# EAGLE design Charge_Controller (EAGLE 9.5.0)
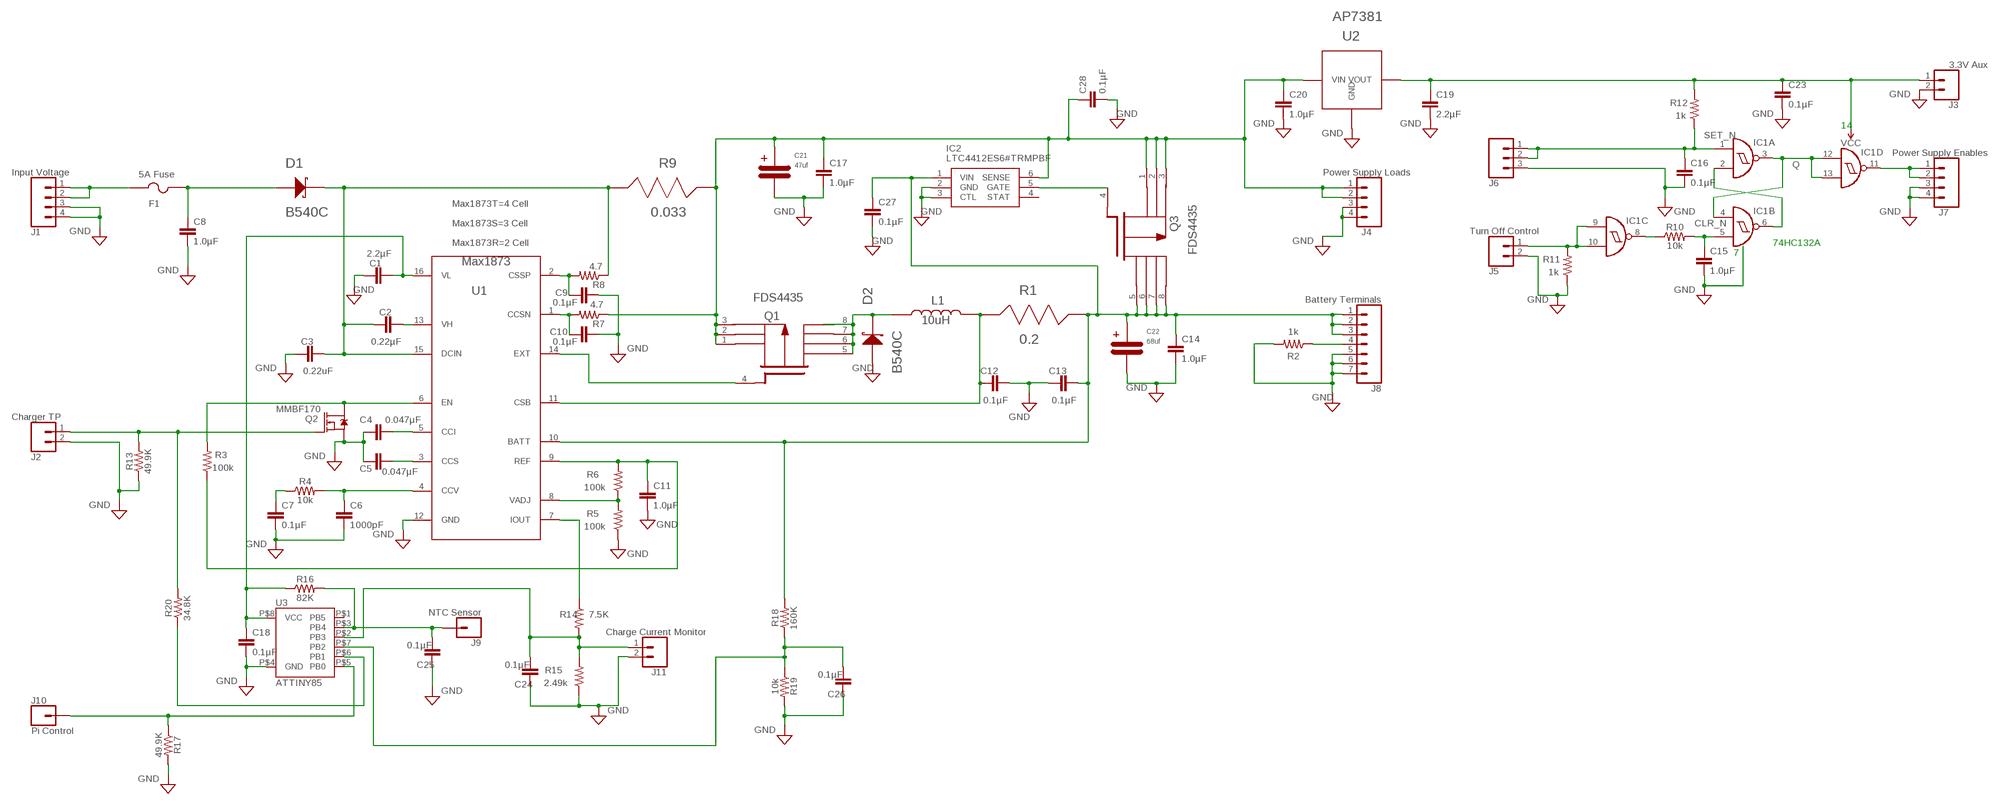
[diagram p0: schematic, sheet 1]

## Parts
C1  2.2µF  0.33UF/330NF-0805-50V-10%  [0805]
C2  0.22µF  0.33UF/330NF-0805-50V-10%  [0805]
C3  0.22uF  0.33UF/330NF-0805-50V-10%  [0805]
C4  0.047µF  0.33UF/330NF-0805-50V-10%  [0805]
C5  0.047µF  0.33UF/330NF-0805-50V-10%  [0805]
C6  1000pF  0.33UF/330NF-0805-50V-10%  [0805]
C7  0.1µF  0.33UF/330NF-0805-50V-10%  [0805]
C8  1.0µF  0.33UF/330NF-0805-50V-10%  [0805]
C9  0.1µF  0.33UF/330NF-0805-50V-10%  [0805]
C10  0.1µF  0.33UF/330NF-0805-50V-10%  [0805]
C11  1.0µF  0.33UF/330NF-0805-50V-10%  [0805]
C12  0.1µF  0.33UF/330NF-0805-50V-10%  [0805]
C13  0.1µF  0.33UF/330NF-0805-50V-10%  [0805]
C14  1.0µF  0.33UF/330NF-0805-50V-10%  [0805]
C15  1.0µF  0.33UF/330NF-0805-50V-10%  [0805]
C16  0.1µF  0.33UF/330NF-0805-50V-10%  [0805]
C17  1.0µF  0.33UF/330NF-0805-50V-10%  [0805]
C18  0.1µF  0.33UF/330NF-0805-50V-10%  [0805]
C19  2.2µF  0.33UF/330NF-0805-50V-10%  [0805]
C20  1.0µF  0.33UF/330NF-0805-50V-10%  [0805]
C21  47uf  2917  [2917]
C22  68uf  2917  [2917]
C23  0.1µF  0.33UF/330NF-0805-50V-10%  [0805]
C24  0.1µF  0.33UF/330NF-0805-50V-10%  [0805]
C25  0.1µF  0.33UF/330NF-0805-50V-10%  [0805]
C26  0.1µF  0.33UF/330NF-0805-50V-10%  [0805]
C27  0.1µF  0.33UF/330NF-0805-50V-10%  [0805]
C28  0.1µF  0.33UF/330NF-0805-50V-10%  [0805]
D1  B540C  [B540C]
D2  B540C  [B540C]
F1  5A Fuse  FUSE1206  [FUSE1206]
IC1  74132D  [SO14]
IC2  LTC4412ES6#TRMPBF  [SOT95P280X100-6N]
J1  Input Voltage  CONN_04  [1X04]
J2  Charger TP  CONN_02  [1X02]
J3  3.3V Aux  CONN_02  [1X02]
J4  Power Supply Loads  CONN_04  [1X04]
J5  Turn Off Control  CONN_02  [1X02]
J6  Turn On  CONN_03  [1X03]
J7  Power Supply Enables  CONN_04  [1X04]
J8  Battery Terminals  CONN_07  [1X07]
J9  NTC Sensor  CONN_01  [1X01]
J10  Pi Control  CONN_01  [1X01]
J11  Charge Current Monitor  CONN_02  [1X02]
L1  10uH  NRS8030  [NRS8030]
Q1  FDS4435  [FDS4435]
Q2  MMBF170  [MMBF170]
Q3  FDS4435  [FDS4435]
R1  0.2  2512  [2512]
R2  1k  1KOHM-0603-1/10W-1%  [0603]
R3  100k  100KOHM-0603-1/10W-1%  [0603]
R4  10k  10KOHM-0603-1/10W-1%  [0603]
R5  100k  100KOHM-0603-1/10W-1%  [0603]
R6  100k  100KOHM-0603-1/10W-1%  [0603]
R7  4.7  0603_4P7  [0603_4P7]
R8  4.7  0603_4P7  [0603_4P7]
R9  0.033  2512  [2512]
R10  10k  10KOHM-0603-1/10W-1%  [0603]
R11  1k  1KOHM-0603-1/10W-1%  [0603]
R12  1k  1KOHM-0603-1/10W-1%  [0603]
R13  49.9K  0603_RESISTOR  [0603_RESISTOR]
R14  7.5K  0603_RESISTOR  [0603_RESISTOR]
R15  2.49k  2.49KOHM-0603-1/10W-1%  [0603]
R16  82K  0603_RESISTOR  [0603_RESISTOR]
R17  49.9K  47KOHM-0603-1/10W-1%  [0603]
R18  160K  0603_RESISTOR  [0603_RESISTOR]
R19  10k  10KOHM-0603-1/10W-1%  [0603]
R20  34.8K  0603_RESISTOR  [0603_RESISTOR]
U1  Max1873  MAX1873  [MAX1873]
U2  AP7381  [AP7381]
U3  ATTINY85  [ATTINY85]

## Nets
BATT: C13.2 C14.1 C22.POS C27.1 IC2.1(VIN) J8.1 J8.2 J8.3 Q3.5(D5) Q3.6(D6) Q3.7(D7) Q3.8(D8) R1.P$2 R18.2 U1.10(BATT)
BATT_ENABLE: J8.4 R2.1
BATT_ISENSE: C12.1 L1.P$2 R1.P$1 U1.11(CSB)
CCI: C4.2 U1.5(CCI)
CCS: C5.2 U1.3(CCS)
CCSN: C10.1 R7.2 U1.1(CCSN)
CCV: C6.1 R4.2 U1.4(CCV)
CCV_MID: C7.1 R4.1
CHARGE_DISABLE: R20.1 U3.P$6(PB1)
CHARGE_MONITOR: C24.2 J11.1 R14.2 R15.2 U3.P$2(PB3)
CLR_N: C15.1 IC1.5(B:I1) R10.2
CSSP: C9.1 R8.2 U1.2(CSSP)
DIODE_GATE: IC2.5(GATE) Q3.4(G4)
DISABLE_GATE: J2.1 Q2.1(G) R13.2 R20.2
EN: Q2.3(D) R3.2 U1.6(EN)
FET_D: D2.P$2 L1.P$1 Q1.5(D5) Q1.6(D6) Q1.7(D7) Q1.8(D8)
FET_G: Q1.4(G4) U1.14(EXT)
GND: C1.1 C3.1 C4.1 C5.1 C6.2 C7.2 C8.2 C9.2 C10.2 C11.2 C12.2 C13.1 C14.2 C15.2 C16.2 C17.2 C18.2 C19.2 C20.2 C21.NEG C22.NEG C23.2 C24.1 C25.1 C26.1 C27.2 C28.2 D2.P$1 IC2.2(GND) IC2.3(CTL) J1.3 J1.4 J2.2 J3.2 J4.3 J4.4 J5.2 J6.3 J7.3 J7.4 J8.5 J8.6 J8.7 J11.2 Q2.2(S) R2.2 R5.1 R11.1 R13.1 R15.1 R17.2 R19.2 U1.12(GND) U2.P$3(GND) U2.P$4(GND) U3.P$4(GND)
INPUT_V: F1.P$1 J1.1 J1.2
N$2: R14.1 U1.7(IOUT)
NTC: C25.2 J9.1 R16.2 U3.P$3(PB4)
PI_CONTROL: J10.1 R17.1 U3.P$5(PB0)
PS_EN: IC1.11(D:O) J7.1 J7.2
Q: IC1.3(A:O) IC1.4(B:I0) IC1.12(D:I0) IC1.13(D:I1)
QBAR: IC1.2(A:I1) IC1.6(B:O)
REF: C11.1 R3.1 R6.2 U1.9(REF)
SET_N: C16.1 IC1.1(A:I0) J6.1 J6.2 R12.1
TURN_OFF: IC1.9(C:I0) IC1.10(C:I1) J5.1 R11.2
TURN_OFF_N: IC1.8(C:O) R10.1
VADJ: R5.2 R6.1 U1.8(VADJ)
VBAT_DIV: C26.2 R18.1 R19.1 U3.P$7(PB2)
VCC: C19.1 C23.1 J3.1 R12.2 U2.P$1(VOUT)
VH: C2.2 U1.13(VH)
VIN_DIODE: C2.1 C3.2 D1.P$2 R8.1 R9.P$2 U1.15(DCIN)
VIN_FUSE: C8.1 D1.P$1 F1.P$2
VL: C1.2 C18.1 R16.1 U1.16(VL) U3.P$8(VCC)
VLOAD: C17.1 C20.1 C21.POS C28.1 IC2.6(SENSE) J4.1 J4.2 Q1.1(S1) Q1.2(S2) Q1.3(S3) Q3.1(S1) Q3.2(S2) Q3.3(S3) R7.1 R9.P$1 U2.P$2(VIN)
Unconnected: IC2.4(STAT) U3.P$1(PB5)

## Notes on the sheet
- 14
- Max1873T=4 Cell
- Max1873S=3 Cell
- Max1873R=2 Cell | 74HC132A
- 7
- 4.7
- 4.7

## Power pins joined to a net without a drawn wire
GND: IC1.7(P:GND)
VCC: IC1.14(P:VCC)

## Library data of the parts
C1-C20 C23-C28 = SparkFun-Capacitors:0.33UF/330NF: 0.33µF/330nF ceramic capacitors A capacitor is a passive two-terminal electrical component used to store electrical energy temporarily in an electric field.; PROD_ID: CAP-08469; VALUE: 0.33µF
C21 C22 = 2917:2917
D1 D2 = B540C:B540C
F1 = FUSE1206:FUSE1206
IC1 = 74xx-us:74*132: Quad 2-input NAND schmitt trigger
IC2 = SamacSys_Parts:LTC4412ES6#TRMPBF: Hot Swap Controller LTC4412ES6#TRMPBF, Positive Voltage, 2.5 28 V, TSOT-23, 6-Pin Source: Datasheet <http://cds.linear.com/docs/en/datasheet/4412fb.pdf>; DESCRIPTION: Hot Swap Controller LTC4412ES6#TRMPBF, Positive Voltage, 2.5 28 V, TSOT-23, 6-Pin; HEIGHT: 1mm; MANUFACTURER_NAME: Linear Technology; MANUFACTURER_PART_NUMBER: LTC4412ES6#TRMPBF; MOUSER_PART_NUMBER: 584-LTC4412ES6TRMPBF; MOUSER_PRICE-STOCK: https://www.mouser.co.uk/ProductDetail/Analog-Devices-Linear-Technology/LTC4412ES6TRMPBF?qs=hVkxg5c3xu8vBeVp9%252BXk%252Bg%3D%3D
J1 J4 J7 = SparkFun-Connectors:CONN_04: Multi connection point. Often used as Generic Header-pin footprint for 0.1 inch spaced/style header connections On any of the 0.1 inch spaced packages, you can populate with these: Break Away Headers - Straight <https://www.sparkfun.com/products/116> (PRT-00116) Break Away Male Headers - Right Angle <https://www.sparkfun.com/products/553> (PRT-00553) Female Headers <https://www.sparkfun.com/products/115> (PRT-00115) Break Away Headers - Machine Pin <https://www.sparkfun.com/products/117> (PRT-00117) Break Away Female Headers - Swiss Machine Pin <https://www.sparkfun.com/products/743> (PRT-00743) For SCREWTERMINALS and SPRING TERMINALS visit here: Screw Terimnals on SparkFun.com <https://www.sparkfun.com/search/results?term=Screw+Terminals> (5mm/3.5mm/2.54mm spacing) This device is also useful as a general connection point to wire up your design to another part of your project. Our various solder wires solder well into these plated through hole pads. Hook-Up Wire - Assortment (Stranded, 22 AWG) <https://www.sparkfun.com/products/11375> (PRT-11375) Hook-Up Wire - Assortment (Solid Core, 22 AWG) <https://www.sparkfun.com/products/11367> (PRT-11367) View the entire wire category on our website here <https://www.sparkfun.com/categories/141> Special notes: Molex polarized connector foot print use with SKU : PRT-08231 with associated crimp pins and housings. 1MM SMD Version SKU: PRT-10208; PROD_ID: CONN-09696
J2 J3 J5 J11 = SparkFun-Connectors:CONN_02: Multi connection point. Often used as Generic Header-pin footprint for 0.1 inch spaced/style header connections On any of the 0.1 inch spaced packages, you can populate with these: Break Away Headers - Straight <https://www.sparkfun.com/products/116> (PRT-00116) Break Away Male Headers - Right Angle <https://www.sparkfun.com/products/553> (PRT-00553) Female Headers <https://www.sparkfun.com/products/115> (PRT-00115) Break Away Headers - Machine Pin <https://www.sparkfun.com/products/117> (PRT-00117) Break Away Female Headers - Swiss Machine Pin <https://www.sparkfun.com/products/743> (PRT-00743) For SCREWTERMINALS and SPRING TERMINALS visit here: Screw Terimnals on SparkFun.com <https://www.sparkfun.com/search/results?term=Screw+Terminals> (5mm/3.5mm/2.54mm spacing) This device is also useful as a general connection point to wire up your design to another part of your project. Our various solder wires solder well into these plated through hole pads. Hook-Up Wire - Assortment (Stranded, 22 AWG) <https://www.sparkfun.com/products/11375> (PRT-11375) Hook-Up Wire - Assortment (Solid Core, 22 AWG) <https://www.sparkfun.com/products/11367> (PRT-11367) View the entire wire category on our website here <https://www.sparkfun.com/categories/141> Special notes: Molex polarized connector foot print use with: PRT-08233 with associated crimp pins and housings. 2.54_SCREWTERM for use with PRT-10571. 3.5mm Screw Terminal footprints for PRT-08084 5mm Screw Terminal footprints for use with PRT-08432
J6 = SparkFun-Connectors:CONN_03: Multi connection point. Often used as Generic Header-pin footprint for 0.1 inch spaced/style header connections On any of the 0.1 inch spaced packages, you can populate with these: Break Away Headers - Straight <https://www.sparkfun.com/products/116> (PRT-00116) Break Away Male Headers - Right Angle <https://www.sparkfun.com/products/553> (PRT-00553) Female Headers <https://www.sparkfun.com/products/115> (PRT-00115) Break Away Headers - Machine Pin <https://www.sparkfun.com/products/117> (PRT-00117) Break Away Female Headers - Swiss Machine Pin <https://www.sparkfun.com/products/743> (PRT-00743) Stackable Header - 3 Pin (Female, 0.1") <https://www.sparkfun.com/products/13875> (PRT-13875) For SCREWTERMINALS and SPRING TERMINALS visit here: Screw Terimnals on SparkFun.com <https://www.sparkfun.com/search/results?term=Screw+Terminals> (5mm/3.5mm/2.54mm spacing) This device is also useful as a general connection point to wire up your design to another part of your project. Our various solder wires solder well into these plated through hole pads. Hook-Up Wire - Assortment (Stranded, 22 AWG) <https://www.sparkfun.com/products/11375> (PRT-11375) Hook-Up Wire - Assortment (Solid Core, 22 AWG) <https://www.sparkfun.com/products/11367> (PRT-11367) View the entire wire category on our website here <https://www.sparkfun.com/categories/141> Special notes: Molex polarized connector foot print use with SKU : PRT-08232 with associated crimp pins and housings.
J8 = SparkFun-Connectors:CONN_07: Multi connection point. Often used as Generic Header-pin footprint for 0.1 inch spaced/style header connections On any of the 0.1 inch spaced packages, you can populate with these: Break Away Headers - Straight <https://www.sparkfun.com/products/116> (PRT-00116) Break Away Male Headers - Right Angle <https://www.sparkfun.com/products/553> (PRT-00553) Female Headers <https://www.sparkfun.com/products/115> (PRT-00115) Break Away Headers - Machine Pin <https://www.sparkfun.com/products/117> (PRT-00117) Break Away Female Headers - Swiss Machine Pin <https://www.sparkfun.com/products/743> (PRT-00743) For SCREWTERMINALS and SPRING TERMINALS visit here: Screw Terimnals on SparkFun.com <https://www.sparkfun.com/search/results?term=Screw+Terminals> (5mm/3.5mm/2.54mm spacing) This device is also useful as a general connection point to wire up your design to another part of your project. Our various solder wires solder well into these plated through hole pads. Hook-Up Wire - Assortment (Stranded, 22 AWG) <https://www.sparkfun.com/products/11375> (PRT-11375) Hook-Up Wire - Assortment (Solid Core, 22 AWG) <https://www.sparkfun.com/products/11367> (PRT-11367) View the entire wire category on our website here <https://www.sparkfun.com/categories/141> Special notes: Molex polarized connector foot print use with SKU : PRT-08231 with associated crimp pins and housings. 1MM SMD Version SKU: PRT-10208 NOTES ON THE VARIANTS LOCK and LOCK_LONGPADS... This footprint was designed to help hold the alignment of a through-hole component (i.e. 6-pin header) while soldering it into place. You may notice that each hole has been shifted either up or down by 0.005 of an inch from it's more standard position (which is a perfectly straight line). This slight alteration caused the pins (the squares in the middle) to touch the edges of the holes. Because they are alternating, it causes a "brace" to hold the component in place. 0.005 has proven to be the perfect amount of "off-center" position when using our standard breakaway headers. Although looks a little odd when you look at the bare footprint, once you have a header in there, the alteration is very hard to notice. Also,if you push a header all the way into place, it is covered up entirely on the bottom side.
J9 J10 = SparkFun-Connectors:CONN_01: Single connection point. Often used as Generic Header-pin footprint for 0.1 inch spaced/style header connections On any of the 0.1 inch spaced packages, you can populate with these: Break Away Headers - Straight <https://www.sparkfun.com/products/116> (PRT-00116) Break Away Male Headers - Right Angle <https://www.sparkfun.com/products/553> (PRT-00553) Female Headers <https://www.sparkfun.com/products/115> (PRT-00115) Break Away Headers - Machine Pin <https://www.sparkfun.com/products/117> (PRT-00117) Break Away Female Headers - Swiss Machine Pin <https://www.sparkfun.com/products/743> (PRT-00743) This device is also useful as a general connection point to wire up your design to another part of your project. Our various solder wires solder well into these plated through hole pads. Hook-Up Wire - Assortment (Stranded, 22 AWG) <https://www.sparkfun.com/products/11375> (PRT-11375) Hook-Up Wire - Assortment (Solid Core, 22 AWG) <https://www.sparkfun.com/products/11367> (PRT-11367) View the entire wire category on our website here <https://www.sparkfun.com/categories/141> Special notes: SMTSO-256-ET is a "flush mount" nut for a 4-40 screw. We mostly use this on specialty testbeds; it is a nice way to connect hardware to your PCB at an adjustable hieght. Also note, the SNAP packages are for using a snappable style connector. We sell a baggie of snaps and they are also used on two LilyPad designs: Snap Assortment - 30 pack (male and female) <https://www.sparkfun.com/products/11347> (DEV-11347) LilyPad Arduino SimpleSnap <https://www.sparkfun.com/products/10941> (DEV-10941) LilyPad SimpleSnap Protoboard <https://www.sparkfun.com/products/10940> (DEV-10940)
L1 = NRS8030:NRS8030
Q1 Q3 = FDS4435:FDS4435: FDS4435BZ P-Channell FET Digikey p/n FDS4435BZCT-ND
Q2 = MMBF170:MMBF170
R1 R9 = 2512:2512
R2 R11 R12 = SparkFun-Resistors:1KOHM: 1kΩ resistor A resistor is a passive two-terminal electrical component that implements electrical resistance as a circuit element. Resistors act to reduce current flow, and, at the same time, act to lower voltage levels within circuits. - Wikipedia; PROD_ID: RES-07856
R3 R5 R6 = SparkFun-Resistors:100KOHM: 100kΩ resistor A resistor is a passive two-terminal electrical component that implements electrical resistance as a circuit element. Resistors act to reduce current flow, and, at the same time, act to lower voltage levels within circuits. - Wikipedia; PROD_ID: RES-07828
R4 R10 R19 = SparkFun-Resistors:10KOHM: 10kΩ resistor A resistor is a passive two-terminal electrical component that implements electrical resistance as a circuit element. Resistors act to reduce current flow, and, at the same time, act to lower voltage levels within circuits. - Wikipedia; PROD_ID: RES-00824
R7 R8 = 0603_4P7:0603_4P7
R13 R14 R16 R18 R20 = 0603_RESISTOR:0603_RESISTOR
R15 = SparkFun-Resistors:2.49KOHM: 2.49kΩ resistor A resistor is a passive two-terminal electrical component that implements electrical resistance as a circuit element. Resistors act to reduce current flow, and, at the same time, act to lower voltage levels within circuits. - Wikipedia; PROD_ID: RES-09568
R17 = SparkFun-Resistors:47KOHM: 47kΩ resistor A resistor is a passive two-terminal electrical component that implements electrical resistance as a circuit element. Resistors act to reduce current flow, and, at the same time, act to lower voltage levels within circuits. - Wikipedia; PROD_ID: RES-07871; VALUE: 47k
U1 = Max1873:MAX1873: Max1873T/S/R - Li+ Battery Charge Controller 4 Cell Digikey number: MAX1873TEEE+-ND 3 Cell Digikey number: MAX1873SEEE+-ND 2 Cell Digikey number: MAX1873REEE+-ND
U2 = AP7381:AP7381
U3 = SparkFun-IC-Microcontroller:ATTINY85; PROD_ID: IC-09092

## Board
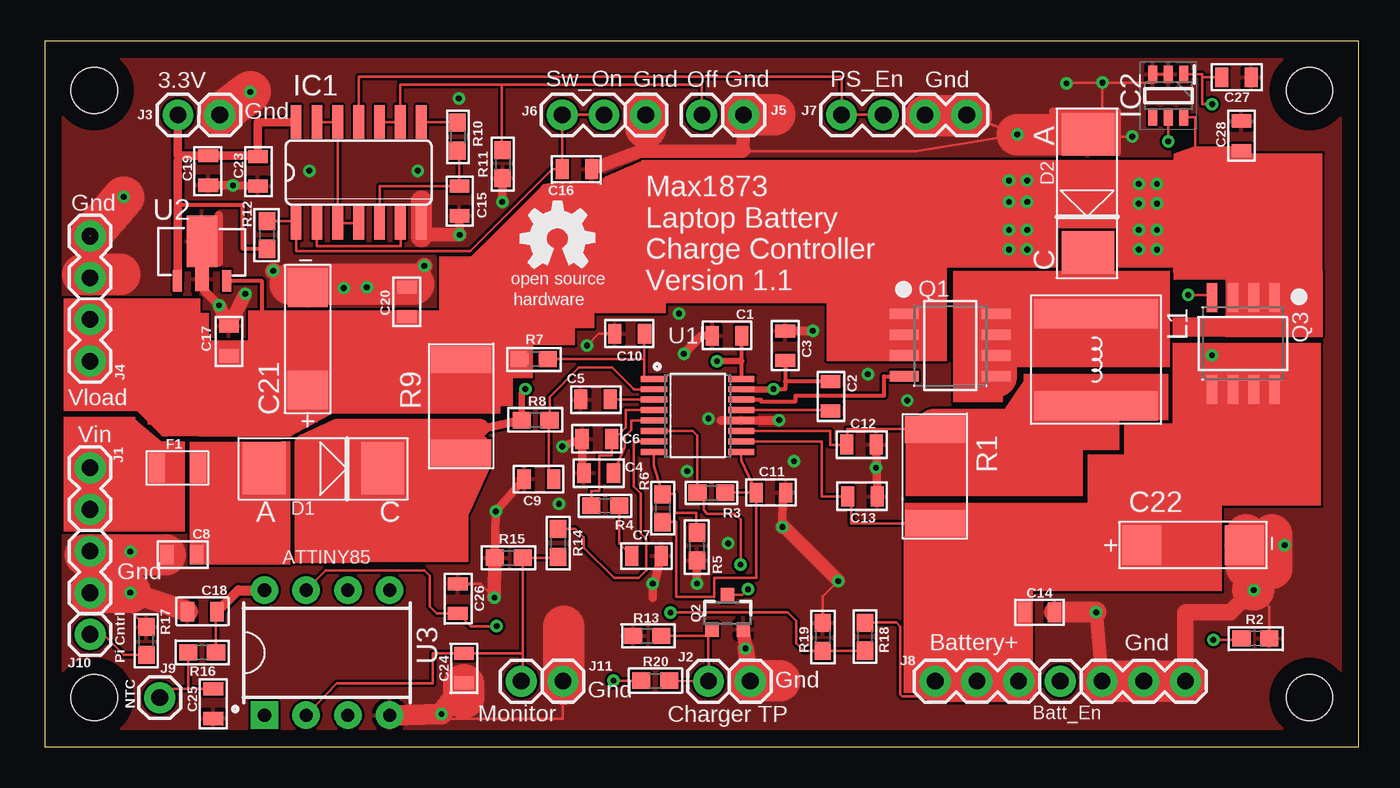
[diagram p1: board, top side]
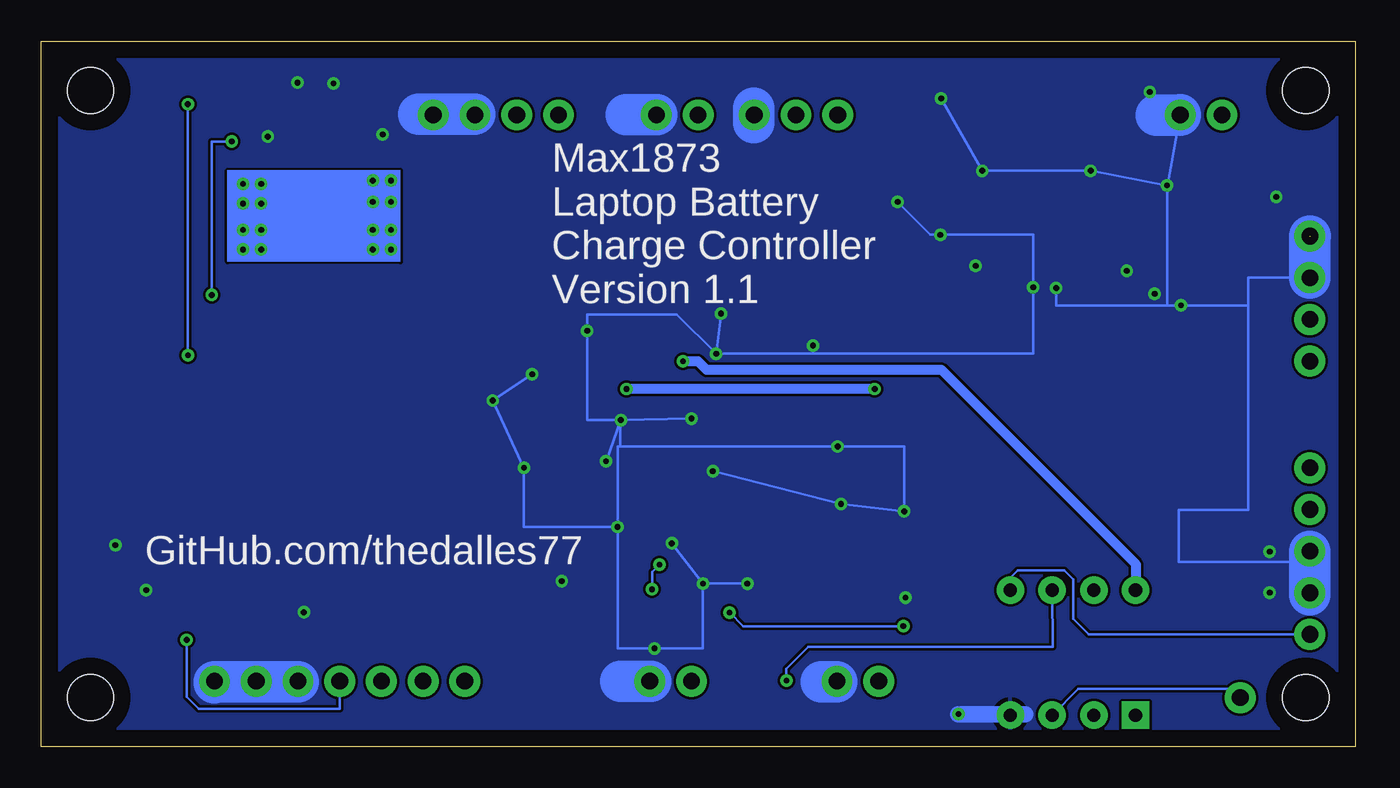
[diagram p2: board, bottom side, seen from below]

Size 80 x 43 mm. Coordinates in mm from the lower left corner, seen from the top.
Outline: 0,0 80,0 80,43 0,43 0,0
Copper layers (1*16): Top 0.035mm / dielectric 1.5mm / Bottom 0.035mm
Design rules "default": minimum track width 6mil, minimum drill 0.35mm, track to track 6mil, track to pad 6mil, pad to pad 6mil, via to via 6mil, smd to smd 6mil, copper to edge 40mil, drill to drill 6mil, minimum pad ring 10mil, minimum via ring 8mil, stop-mask expansion 4mil, vias tented up to drill 0mil, thermal gap 10mil
Holes 2.8 mm at 77,40 77,3 3,3 3,40

### Footprints (pad centres in the part's own frame; a part is rotated, then mirrored left to right if it is on the bottom)
0805 = smd 0.8 x 1.2: 1 -0.9,0; 2 0.9,0
2917 = smd 2.37 x 2.43: NEG 3.12,0; POS -3.12,0
B540C = smd 2.6 x 3.2: P$1 -3.6,0; P$2 3.6,0
FUSE1206 = smd 1 x 1.8: P$1 -1.25,0; P$2 1.25,0
SO14 = smd 0.66 x 2.032: 1 -3.81,-3.073; 2 -2.54,-3.073; 3 -1.27,-3.073; 4 0,-3.073; 5 1.27,-3.073; 6 2.54,-3.073; 7 3.81,-3.073; 8 3.81,3.073; 9 2.54,3.073; 10 1.27,3.073; 11 0,3.073; 12 -1.27,3.073; 13 -2.54,3.073; 14 -3.81,3.073
SOT95P280X100-6N = smd 1.05 x 0.55: 1 -1.3,0.95; 2 -1.3,0; 3 -1.3,-0.95; 4 1.3,-0.95; 5 1.3,0; 6 1.3,0.95
1X04 = drill 1.016 pad 1.88: 1 0,0; 2 2.54,0; 3 5.08,0; 4 7.62,0
1X02 = drill 1.016 pad 1.88: 1 0,0; 2 2.54,0
1X03 = drill 1.016 pad 1.88: 1 0,0; 2 2.54,0; 3 5.08,0
1X07 = drill 1.016 pad 1.88: 1 0,0; 2 2.54,0; 3 5.08,0; 4 7.62,0; 5 10.16,0; 6 12.7,0; 7 15.24,0
1X01 = drill 1.016 pad 1.88: 1 0,0
NRS8030 = smd 1.8 x 7.5: P$1 -2.8,0; P$2 2.8,0
FDS4435 = smd 1.75 x 0.65: 1 1.2,5.01; 2 1.2,3.74; 3 1.2,2.47; 4 1.2,1.2; 5 6.8,1.2; 6 6.8,2.47; 7 6.8,3.74; 8 6.8,5.01
MMBF170 = smd 0.8 x 0.9: 1 -0.95,-1; 2 0.95,-1; 3 0,1.1
2512 = smd 1.65 x 3.68: P$1 -2.855,0; P$2 2.855,0
0603 = smd 1.1 x 1: 1 -0.85,0; 2 0.85,0
0603_4P7 = smd 1.1 x 1: 1 -0.85,0; 2 0.85,0
0603_RESISTOR = smd 1.1 x 1: 1 -0.85,0; 2 0.85,0
MAX1873 = smd 1.6 x 0.36: 1 -2.6,2.25; 2 -2.6,1.615; 3 -2.6,0.98; 4 -2.6,0.345; 5 -2.6,-0.29; 6 -2.6,-0.925; 7 -2.6,-1.56; 8 -2.6,-2.195; 9 2.71,-2.195; 10 2.71,-1.56; 11 2.71,-0.925; 12 2.71,-0.29; 13 2.71,0.345; 14 2.71,0.98; 15 2.71,1.615; 16 2.71,2.25
AP7381 = smd 0.55 x 1.3: P$1 -1.5,0; P$2 1.5,0 | smd 0.8 x 1.475: P$3 0,0.1 | smd 1.85 x 3.125: P$4 0,2.4
ATTINY85 = drill 0.8 pad 1.676 square: P$1 -3.81,3.81 | drill 0.8 pad 1.676: P$2 -3.81,1.27; P$3 -3.81,-1.27; P$4 -3.81,-3.81; P$5 3.81,-3.81; P$6 3.81,-1.27; P$7 3.81,1.27; P$8 3.81,3.81

### Placement (x,y rotation side)
C1  41.52,25.05 0 top
C2  47.83,21.36 270 top
C3  45.07,24.43 270 top
C4  33.72,16.68 0 top
C5  33.52,21.17 0 top
C6  33.6,18.76 180 top
C7  36.63,11.63 0 top
C8  8.33,11.71 180 top
C9  30.07,16.31 180 top
C10  35.6,25.17 180 top
C11  44.21,15.49 0 top
C12  49.72,18.42 0 top
C13  49.77,15.26 180 top
C14  60.55,8.2 0 top
C15  25.24,33.25 270 top
C16  32.4,35.2 0 top
C17  11.2,24.73 90 top
C18  9.58,8.24 180 top
C19  9.94,35.11 270 top
C20  22.04,27.12 90 top
C21  15.99,24.85 90 top
C22  69.9,12.29 0 top
C23  12.97,35.06 270 top
C24  25.52,4.8 90 top
C25  10.24,2.63 90 top
C26  25.14,9.03 270 top
C27  72.55,40.79 0 top
C28  72.85,37.23 90 top
D1  16.95,16.99 0 top
D2  63.5,33.71 270 top
F1  8.06,16.99 0 top
IC1  19.1,34.99 0 top
IC2  68.39,39.67 270 top
J1  2.75,17 270 top
J2  40.4,4 0 top
J3  8.1,38.5 0 top
J4  2.75,23.5 90 top
J5  40,38.5 0 top
J6  31.5,38.5 0 top
J7  48.5,38.5 0 top
J8  54.2,4 0 top
J9  6.99,3 0 top
J10  2.75,6.85 0 top
J11  29,4 0 top
L1  63.99,23.57 270 top
Q1  51.12,21.37 0 top
Q2  41.56,8.15 0 top
Q3  69.86,28.57 270 top
R1  54.18,16.48 270 top
R2  73.7,6.61 0 top
R3  40.58,15.49 180 top
R4  34.11,14.7 180 top
R5  39.69,12.2 90 top
R6  37.6,14.54 270 top
R7  29.76,23.63 0 top
R8  29.87,19.91 0 top
R9  25.34,20.75 270 top
R10  25.12,37.17 270 top
R11  27.87,35.49 90 top
R12  13.51,31.19 270 top
R13  36.66,6.76 0 top
R14  31.25,12.41 270 top
R15  28.23,11.52 0 top
R16  9.56,5.76 180 top
R17  6.18,6.46 90 top
R18  49.93,6.71 90 top
R19  47.35,6.7 90 top
R20  37.16,4.03 0 top
U1  39.68,20.17 0 top
U2  9.56,28.4 0 top
U3  17.18,5.74 90 top
U$1  [OSHW_5MM]  31.2,30.96 0 top

### Tracks (layer width: path | path; a pad name or v marks a point on that pad's centre or on a via)
BATT  (via drill 0.35)
  Top 0.152: U1.10 47.3,18.61 47.3,15.25 C13.2 49.1,15.26 49.1,13.6 54.18,13.6 | C14.1 54.18,8.2 | 54.18,8.2 54.18,8.25 | J8.1 53.41,3.21 | 53.41,3.21 53.27,3.07 52.2,3.07 52.07,3.21 52.07,7.32 51.82,7.58 49.94,7.58 R18.2 | 54.18,8.2 53.41,7.43 53.41,3.21 | Q3.8 Q3.7 | Q3.7 Q3.6 Q3.5 v71.06,23.86 | IC2.1 70.47,40.97 70.47,40.79 | v71.06,39.16 70.47,39.16 70.47,40.78 70.47,40.79 | Q3.7 73.59,18.03 73.03,18.03 | C27.1 70.47,40.79
  Top 2.54: 73.03,18.03 C22.POS 59.16,12.29 57.85,13.6 54.18,13.6 | J8.3 J8.2 J8.1 54.2,8.25 54.18,8.25 54.18,13.6 | R1.P$2 54.18,13.6
  Bottom 0.152: v71.06,23.86 v71.06,39.16
BATT_ENABLE  (via drill 0.35)
  Top 0.152: v71.14,6.52 72.76,6.52 R2.1
  Bottom 0.152: J8.4 61.82,2.32 70.4,2.32 71.14,3.06 v71.14,6.52
BATT_ISENSE
  Top 0.152: U1.11 47.8,19.25 47.8,18.4 48.82,18.4 C12.1 48.85,18.42 48.85,19.38 52.85,19.38 52.85,19.35 R1.P$1
  Top 2.54: L1.P$2 64.15,20.77 64.15,19.34 R1.P$1
CCI
  Top 0.152: U1.5 35.7,19.88 35.7,19.3 35.3,18.9 35.3,18.27 C4.2
CCS
  Top 0.152: C5.2 37.06,21.17 U1.3
CCSN
  Top 0.152: R7.2 36.5,23.63 | 36.5,23.63 36.5,22.4 | C10.1 36.5,23.63
  Top 0.254: 36.5,22.4 37.08,22.4 U1.1
CCV
  Top 0.152: U1.4 35.35,20.52 35.35,19.45 34.66,18.76 C6.1 34.5,17.75 33.75,17.75 33.75,15.6 33.25,15.6 R4.2
CCV_MID
  Top 0.152: C7.1 34.96,12.4 R4.1
CHARGE_DISABLE  (via drill 0.35)
  Top 0.152: R20.1 34.66,4.03 v34.62,4.04
  Bottom 0.152: v34.62,4.04 34.62,4.76 33.28,6.11 18.4,6.11 U3.P$6
CHARGE_MONITOR
  Top 0.152: U3.P$2 17.76,3.86 23.6,3.86 23.6,5.7 C24.2 29.08,5.7 | 29.08,5.7 R15.2 31.2,11.52 R14.2 | 29.08,5.7 29.08,4.08 J11.1
CLR_N
  Top 0.152: IC1.5 20.37,34.15 C15.1 25.24,36.32 R10.2
CSSP
  Top 0.152: C9.1 30.67,16.61 30.67,19.86 R8.2 30.72,21.32 32.5,23.1 34.55,23.1 35.85,21.8 35.85,21.79 U1.2
DIODE_GATE  (via drill 0.35)
  Top 0.152: IC2.5 v68.39,36.88 | v69.61,27.53 71.06,27.53 Q3.4
  Bottom 0.152: v69.61,27.53 69.61,36.88 v68.39,36.88
DISABLE_GATE
  Top 0.152: Q2.1 40.39,6.93 40.39,6.77 | 40.39,6.77 J2.1 R20.2 | R13.2 40.39,6.76 40.39,6.77
EN  (via drill 0.35)
  Top 0.152: Q2.3 42.45,9.25 v42.8,9.6 | U1.6 39.45,19.25 39.73,18.97 39.73,15.55 R3.2 40.12,15.11 40.12,14.43 40.34,14.21 42.01,14.21 42.35,13.86 v42.35,11.1
  Bottom 0.152: v42.35,11.1 42.8,10.65 v42.8,9.6
FET_D
  Top 2.54: D2.P$2 63.5,26.86 L1.P$1 Q1.8 Q1.7 Q1.6 Q1.5
FET_G
  Top 0.254: U1.14 43.59,21.15 43.59,21.04 45.7,21.04 45.7,21.4 51.1,21.4 51.1,22.57 Q1.4
GND  (via drill 0.35)  (1 unrouted)
  Top 0.152: U2.P$4 9.56,29.39 | 9.56,29.39 U2.P$3 | C10.2 33.73,25.17 v33.01,24.45 | 42.5,36.3 53.05,36.3 v59.2,37.31 J7.4 J7.3 | v24.14,2 24.43,1.71 31.54,1.71 J11.2 | v5.2,11.9 C8.2 | R2.2 74.55,8.53 73.53,9.55 | C22.NEG 73.14,12.68 73.14,12.92 | C20.2 22.21,28.19 22.44,28.19 | 10.6,29.5 10.6,29.39 9.56,29.39 | R19.2 47.35,9.15 v48.3,10.1 | C26.1 26.54,9.93 v27.37,9.1 | R17.2 5.2,8.29 v5.2,9.4 | IC2.2 IC2.3 67.44,40.47 v64.38,40.47 | v62.2,40.41 62.2,40.47 v64.38,40.47 | v64.38,40.47 64.38,37.33 63.48,37.33 | v66.2,37.18 63.63,37.18 D2.P$1
  Top 0.254: v11.45,34.21 v11.45,34.2
  Top 0.508: C19.2 v11.45,34.21 C23.2 | v10.6,26.9 9.69,27.81 U2.P$3 | C20.2 21.69,28 | C15.2 25.25,31.15 v25.25,31.2 | 22.95,31.2 IC1.7 | R11.1 v27.85,33.2 | 32.62,18.76 C6.2 | C6.2 32.7,17.4 | C6.2 v31.5,18.3 | C9.2 v27.45,14.35 R15.1 | 37,9.06 v37,9.95 37.14,10.09 C7.2 | R5.1 v39.69,9.95 v39.7,9.95 | 42.66,6 v42.65,6 | C11.2 44.91,15.3 v44.9,13.4 | C12.2 50.65,17 | 50.65,17 v50.6,17 | C13.1 50.65,17 | C1.1 40,25.05 v38.9,23.95 | v44.7,19.91 44.65,19.91 44.65,19.88 U1.12 41.15,19.88 | C3.1 46.75,25.33 v46.75,25.35 | v5.2,9.4 5.2,9.43 | 10.6,32.4 10.6,29.5 | 61.38,38.7 65.24,38.7 65.24,36.24
  Top 0.813: v10.6,26.9 C17.2 v12.2,27.6 | v25.25,31.2 22.95,31.2 | 42.66,6 42.51,7.1 | R15.1 v27.37,9.1 27.34,9.13 | 42.5,36.3 36.24,36.3 C16.2 | 42.54,36.34 42.5,36.3 | v48.3,10.1 45,13.4 v44.9,13.4 | v64,8.2 J8.5 | 42.5,36.3 42.56,38.52
  Top 1.016: J2.2 42.66,6 | v13.9,29 C21.NEG | v23.1,29.3 C20.2 | J8.7 69.44,8.15 69.47,8.19 72.17,8.19 73.53,9.55
  Top 1.27: v64,8.2 C14.2 | J4.4 J4.3 | v5.2,11.9 J1.3 J1.4 | C24.1 v24.14,2 U3.P$4 | C18.2 v5.2,9.4 | 22.91,33.27 22.91,31.07 22.93,31.07
  Top 2.54: v59.2,37.31 D2.P$1 | D2.P$1 | 73.53,9.55 v73.6,9.55 | 63.48,37.33 D2.P$1 | v12.5,39.9 J3.2 | v4.8,33.5 J4.4 | J1.4 v5.2,9.4 | J8.5 J8.6 J8.7 | 42.56,38.52 44.44,38.52 | J3.2 12.28,39.77 | 53.64,38.46 56.4,38.46 | 42.86,4.01 44.73,4.01 | 36.56,38.65 36.56,37.73 | 2.31,28.79 4.55,28.79 4.57,28.8 | 4.6,11.67 7.32,11.68 | 2.45,11.69 4.39,11.69 4.41,11.68 | 25.5,3.78 25.5,3 | 31.59,7.34 31.59,3.81 | 73.14,12.92 73.14,10.97 73.23,10.88 74.68,10.88 74.68,12.89 74.69,12.9 | 22.44,28.19 14.94,28.19
  Bottom 0.152: 11.45,26.9 v10.6,26.9 6.5,26.9 | 11.45,26.9 18.2,26.9 v18.2,27.95 | 11.45,34.1 v11.45,34.2 v16.1,35.1 v22.7,35.1 v25.2,39.5 | 11.45,34.1 11.45,26.9 | v38.9,23.95 33.01,23.95 | v38.9,23.95 41.3,26.35 46.75,26.35 v46.75,25.35 46.75,19.91 44.75,19.91 | v44.7,19.91 44.75,19.91 | 44.75,18.3 v31.5,18.3 27.45,18.3 v27.45,14.35 v31.3,14.8 v39.1,16.8 | 44.75,18.3 44.75,19.91 | v44.9,13.4 44.9,18.3 44.75,18.3 | v44.9,13.4 50.6,13.4 v50.6,17 v52.5,21.1 v50.1,22.7 | v39.7,9.95 39.7,6 v42.65,6 44.9,6 v44.9,13.4 | v37,9.95 v39.7,9.95 | 6.5,26.9 6.5,14.45 10.75,14.45 10.75,11.26 3.42,11.26 J1.3 | 33.01,23.95 19.6,23.95 v19.6,28 19.6,31.2 v25.25,31.2 25.85,31.2 v27.85,33.2 | J4.3 6.5,28.58 6.5,26.9 | v33.01,24.45 33.01,23.95 | v45.6,17.4 v44.7,19.91 | J3.2 11.45,34.1 | v38.6,26.4 v38.9,23.95 | v44.7,19.91 v40.4,20 | v39.7,9.95 v41.6,12.4
  Bottom 1.016: 24.16,1.99 20.07,1.99 20.07,1.98
  Bottom 2.54: 2.75,28.55 J4.4 2.72,31.11 | 2.77,11.92 2.77,9.27 | 64.34,3.96 69.47,3.96 69.47,3.91 | J5.2 44.37,38.5 | J3.2 10.64,38.47 12.12,38.47 | 53.61,38.53 57,38.53 | 42.88,4 44.72,4 | 31.55,3.97 32.5,3.97 | 36.6,38.92 36.6,38.04 36.62,38.04
  other vias: 75.48,12.29
  pour Top: 0.05,0 0.05,42.95 80,42.95 80,0
  pour Bottom: 0.05,0 0.05,42.9 79.99,42.9 79.99,0
INPUT_V
  Top 1.016: F1.P$1 5.95,16.99 5.95,17
  Top 2.54: 5.95,17 2.98,17 | 2.98,17 J1.1 | J1.2 2.75,16.77 2.98,17
N$1
  Top 0.508: 70.03,36.32 68.98,35.95
N$2
  Top 0.152: U1.7 35.84,18.61 35.84,15.87 36.28,15.43 36.28,13 36.62,12.66 36.62,10.76 36.15,10.29 34.66,10.29 32.8,12.13 32.8,12.75 32.28,13.27 R14.1
N$11
  Top 0.508: 53.1,23.9 53.7,24.5
N$13
  Top 1.016: 26.67,17.27 25.02,13.64
N$35
  Top 1.016: 5.2,19.5 6,18.2
N$36
  Top 0.508: 54.2,23.75 52.9,23.75
N$37
  Top 0.61: 56.3,21.62 57.9,21.62
N$38
  Top 1.016: 60,22 58.9,20.4
N$40
  Top 1.016: 7.5,17.6 7.5,13.65
N$42
  Top 1.016: 7.3,17.8 5.3,19.5
NTC
  Top 0.152: C25.2 8.71,3.53 | 8.71,3.53 7.52,3.53 J9.1 | R16.2 8.71,3.54 8.71,3.53
  Bottom 0.152: U3.P$3 16.84,3.53 7.52,3.53 J9.1
PI_CONTROL
  Top 0.152: R17.1 4.79,5.61 3.54,6.85 J10.1
  Bottom 0.152: U3.P$5 20.98,10.29 20.52,10.76 17.71,10.76 17.16,10.2 17.16,7.8 16.2,6.85 J10.1
PS_EN
  Top 0.152: IC1.11 19.1,40.83 48.5,40.83 J7.1 J7.2
Q
  Top 0.152: IC1.4 IC1.3 IC1.12 IC1.13
QBAR
  Top 0.152: IC1.2 16.56,30.5 21.65,30.5 IC1.6
REF
  Top 0.152: C11.1 42.39,17.45 U1.9 | C11.1 R3.1 | R6.2 38.45,13.7 38.45,9.15 40.75,9.15 40.75,10.31 43.3,10.31 43.3,10.7 C11.1
SET_N
  Top 0.152: R12.1 15.29,32.04 IC1.1 15.29,30.2 25.9,30.2 30.9,35.2 C16.1 J6.1 J6.2
TURN_OFF
  Top 0.152: IC1.10 IC1.9 21.64,40.35 27.8,40.35 | J5.1 40,40.35 27.8,40.35 | 27.8,40.35 27.8,36.34 R11.2
TURN_OFF_N
  Top 0.152: IC1.8 25.12,38.06 R10.1
VADJ
  Top 0.152: U1.8 37.08,17.14 R6.1 38.35,15.4 38.35,14.3 38.4,14.25 39.65,14.25 39.65,13.09 R5.2
VBAT_DIV  (via drill 0.35)
  Top 0.152: v38.08,8.18 45.24,8.18 45.73,7.69 45.73,6.31 46.19,5.85 R19.1 49.91,5.85 R18.1 | v27.5,7.36 25.91,7.36 C26.2 23.85,8.13 23.43,8.55 23.43,10.4 23.09,10.74 17.1,10.74 U3.P$7
  Bottom 0.152: v38.08,8.18 37.26,7.36 v27.5,7.36
VCC
  Top 0.254: 12.97,36.01 C23.1 | R12.2 12.05,30.34 12.05,33 8.1,33 | 8.1,35.72 8.1,35.7
  Top 0.406: U2.P$1 8.1,28.4 | 8.1,35.72 8.1,36.01 | J3.1 8.1,38.55
  Top 0.508: 8.1,28.4 8.1,33 8.1,35.7 | 12.97,36.01 C19.1 8.1,36.01 8.1,38.55 | C23.1 12.97,38.06 IC1.14
VH
  Top 0.152: U1.13 47.83,20.52 C2.2
VIN_DIODE  (via drill 0.35)
  Top 0.152: 15.7,18.5 16,18.5 | R9.P$2 26.5,18.5
  Top 0.254: v44.35,21.8 44.35,21.79 45.07,21.79 45.07,22.26 | C3.2 45.07,22.26 | C2.1 45.07,22.26
  Top 0.406: v29.25,21.8 29.02,21.57 R8.1 | 44.35,21.79 U1.15
  Top 0.508: R8.1 26.88,19.43 R9.P$2
  Top 1.016: 26.5,19.5 17.8,19.5 15.7,18.5 | 26.5,18.5 16,18.5
  Top 2.54: D1.P$2 25.34,16.99 R9.P$2
  Bottom 0.61: v29.25,21.8 v44.35,21.8
VIN_FUSE
  Top 0.152: C8.1 F1.P$2
  Top 1.016: F1.P$2 D1.P$1
VL  (via drill 0.35)
  Top 0.152: R16.1 10.41,8.18 C18.1
  Top 0.254: C1.2 42.39,25.05 42.39,23.5 U1.16
  Top 0.406: 42.39,23.5 v40.91,23.5
  Top 0.61: C18.1 11.78,9.54 U3.P$8
  Bottom 0.61: v40.91,23.5 40.02,23.5 39.49,22.98 25.2,22.98 13.34,11.11 U3.P$8
VLOAD  (via drill 0.35)
  Top 0.152: Q1.3 Q1.1 | v59.8,30.3 v58.7,30.3 v58.7,31.5 v59.8,31.5 v59.8,33.2 v58.7,33.2 v58.7,34.5 v59.8,34.5 v66.6,34.3 v67.7,34.3 | v67.7,34.3 v67.7,33.1 | v67.7,33.1 v66.6,33.1 | IC2.6 70.03,38.37 70.03,36.34 70.03,36.05 72.33,36.05 72.33,34.12 | 73.03,33.6 73.03,33.83 72.33,33.83 Q3.3 | Q3.3 72.33,34.12 | Q3.1 Q3.2 Q3.3 | v67.7,34.3 72.33,34.12 | J4.1 C17.1 | C17.1 11.26,22.02 13.2,21.9 C21.POS 22.19,21.73 22.19,24.88 C20.1 | C20.1 R9.P$1 | Q1.3 52.3,29.11 | Q1.3 51.88,24.28 51.88,27.8 51.74,27.94 47.28,27.94 29,27.96 R7.1 | v67.7,30.3 v66.6,30.3 v66.6,31.5 v67.7,31.5 v67.7,33.1 | C17.1 14.84,19.32 | C20.1 25.86,26.21 25.88,29.39 | 34.17,34.55 34.16,33.98
  Top 0.254: U2.P$2 13.2,28.4 13.2,21.9 | Q1.3 52.25,23.84 52.25,24.55 52.32,24.55 Q1.3
  Top 0.406: 36.42,35.54 34.17,34.55
  Top 0.508: R7.1 28.86,23.58 R9.P$1 | C28.1 70.03,36.34 | 5.62,21.01 J4.1 | C21.POS C17.1
  Top 0.61: 25.88,29.39 30.46,33.98 34.16,33.98
  Top 0.813: 14.84,19.32 17.84,20.93 | 7.32,19.32 5.62,21.01
  Top 2.54: 52.3,33.6 52.3,29.11 52.3,26.38 Q1.1 Q1.2 | J4.2 J4.1
  Top 3: 52.3,33.6 73.03,33.6
(copper drawn outside any net)
  shapes: Bottom area x1, Top area x69

### Text on the board
tPlace: 3.3V | Sw_On | Gnd | Off | Gnd | PS_En | Gnd | Gnd | Gnd | Max1873 / Laptop Battery / Charge Controller / Version 1.1 | Vload | C21 | Vin | Gnd | Battery+ | Gnd | Pi Cntrl | Gnd | Gnd | NTC | Monitor | Charger TP | Batt_En
bPlace: Max1873 / Laptop Battery / Charge Controller / Version 1.1 | GitHub.com/thedalles77
Document: Turn On Control
tDocu: 4.7 | 4.7 | 1K